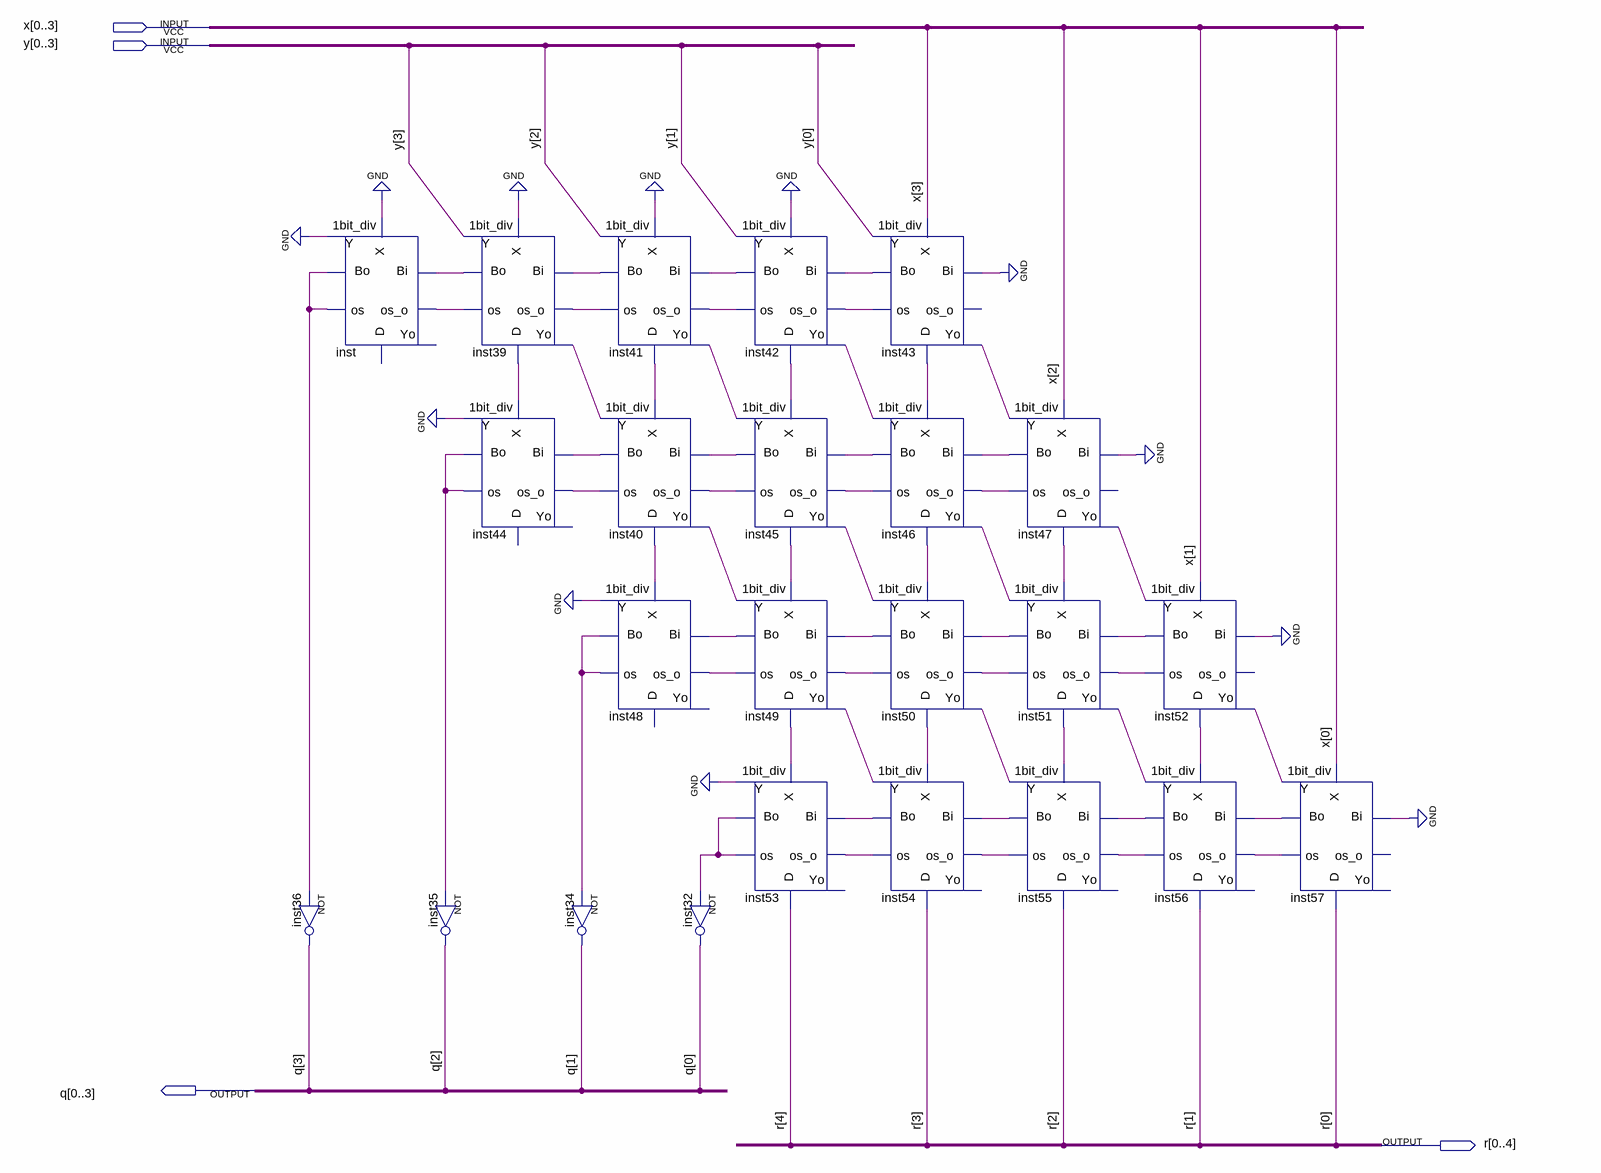
[diagram p0: schematic sheet]
// Quartus schematic 4bit_div.bdf as structural Verilog: 24 symbols, 4 pins
module \4bit_div  (
  input  [0:3] x,
  input  [0:3] y,
  output [0:3] q,
  output [0:4] r
);

  wire inst39_bo, inst39_d, inst39_os_o, inst39_yo, inst40_bo, inst40_d, inst40_os_o, inst40_yo, inst41_bo,
       inst41_d, inst41_os_o, inst41_yo, inst42_bo, inst42_d, inst42_os_o, inst42_yo, inst43_bo, inst43_d,
       inst43_yo, inst44_bo, inst44_os_o, inst45_bo, inst45_d, inst45_os_o, inst45_yo, inst46_bo, inst46_d,
       inst46_os_o, inst46_yo, inst47_bo, inst47_d, inst47_yo, inst48_bo, inst48_os_o, inst49_bo, inst49_d,
       inst49_os_o, inst49_yo, inst50_bo, inst50_d, inst50_os_o, inst50_yo, inst51_bo, inst51_d, inst51_os_o,
       inst51_yo, inst52_bo, inst52_d, inst52_yo, inst53_bo, inst53_os_o, inst54_bo, inst54_os_o, inst55_bo,
       inst55_os_o, inst56_bo, inst56_os_o, inst57_bo, inst_bo, inst_os_o;

  \1bit_div  inst (.Y(1'b0), .X(1'b0), .Bi(inst39_bo), .os(inst_bo), .Bo(inst_bo), .os_o(inst_os_o));  // open: Yo, D
  not inst36 (q[3], inst_bo);
  \1bit_div  inst39 (
    .Y(y[3]), .X(1'b0), .Bi(inst41_bo), .os(inst_os_o), .Yo(inst39_yo), .Bo(inst39_bo), .os_o(inst39_os_o),
    .D(inst39_d));
  \1bit_div  inst44 (
    .Y(1'b0), .X(inst39_d), .Bi(inst40_bo), .os(inst44_bo), .Bo(inst44_bo), .os_o(inst44_os_o));  // open: Yo, D
  not inst35 (q[2], inst44_bo);
  \1bit_div  inst41 (
    .Y(y[2]), .X(1'b0), .Bi(inst42_bo), .os(inst39_os_o), .Yo(inst41_yo), .Bo(inst41_bo), .os_o(inst41_os_o),
    .D(inst41_d));
  \1bit_div  inst40 (
    .Y(inst39_yo), .X(inst41_d), .Bi(inst45_bo), .os(inst44_os_o), .Yo(inst40_yo), .Bo(inst40_bo),
    .os_o(inst40_os_o), .D(inst40_d));
  \1bit_div  inst48 (
    .Y(1'b0), .X(inst40_d), .Bi(inst49_bo), .os(inst48_bo), .Bo(inst48_bo), .os_o(inst48_os_o));  // open: Yo, D
  not inst34 (q[1], inst48_bo);
  not inst32 (q[0], inst53_bo);
  \1bit_div  inst42 (
    .Y(y[1]), .X(1'b0), .Bi(inst43_bo), .os(inst41_os_o), .Yo(inst42_yo), .Bo(inst42_bo), .os_o(inst42_os_o),
    .D(inst42_d));
  \1bit_div  inst45 (
    .Y(inst41_yo), .X(inst42_d), .Bi(inst46_bo), .os(inst40_os_o), .Yo(inst45_yo), .Bo(inst45_bo),
    .os_o(inst45_os_o), .D(inst45_d));
  \1bit_div  inst49 (
    .Y(inst40_yo), .X(inst45_d), .Bi(inst50_bo), .os(inst48_os_o), .Yo(inst49_yo), .Bo(inst49_bo),
    .os_o(inst49_os_o), .D(inst49_d));
  \1bit_div  inst53 (
    .Y(1'b0), .X(inst49_d), .Bi(inst54_bo), .os(inst53_bo), .Bo(inst53_bo), .os_o(inst53_os_o), .D(r[4]));  // open: Yo
  \1bit_div  inst43 (
    .Y(y[0]), .X(x[3]), .Bi(1'b0), .os(inst42_os_o), .Yo(inst43_yo), .Bo(inst43_bo), .D(inst43_d));  // open: os_o
  \1bit_div  inst46 (
    .Y(inst42_yo), .X(inst43_d), .Bi(inst47_bo), .os(inst45_os_o), .Yo(inst46_yo), .Bo(inst46_bo),
    .os_o(inst46_os_o), .D(inst46_d));
  \1bit_div  inst50 (
    .Y(inst45_yo), .X(inst46_d), .Bi(inst51_bo), .os(inst49_os_o), .Yo(inst50_yo), .Bo(inst50_bo),
    .os_o(inst50_os_o), .D(inst50_d));
  \1bit_div  inst54 (
    .Y(inst49_yo), .X(inst50_d), .Bi(inst55_bo), .os(inst53_os_o), .Bo(inst54_bo), .os_o(inst54_os_o),
    .D(r[3]));  // open: Yo
  \1bit_div  inst47 (
    .Y(inst43_yo), .X(x[2]), .Bi(1'b0), .os(inst46_os_o), .Yo(inst47_yo), .Bo(inst47_bo), .D(inst47_d));  // open: os_o
  \1bit_div  inst51 (
    .Y(inst46_yo), .X(inst47_d), .Bi(inst52_bo), .os(inst50_os_o), .Yo(inst51_yo), .Bo(inst51_bo),
    .os_o(inst51_os_o), .D(inst51_d));
  \1bit_div  inst55 (
    .Y(inst50_yo), .X(inst51_d), .Bi(inst56_bo), .os(inst54_os_o), .Bo(inst55_bo), .os_o(inst55_os_o),
    .D(r[2]));  // open: Yo
  \1bit_div  inst52 (
    .Y(inst47_yo), .X(x[1]), .Bi(1'b0), .os(inst51_os_o), .Yo(inst52_yo), .Bo(inst52_bo), .D(inst52_d));  // open: os_o
  \1bit_div  inst56 (
    .Y(inst51_yo), .X(inst52_d), .Bi(inst57_bo), .os(inst55_os_o), .Bo(inst56_bo), .os_o(inst56_os_o),
    .D(r[1]));  // open: Yo
  \1bit_div  inst57 (.Y(inst52_yo), .X(x[0]), .Bi(1'b0), .os(inst56_os_o), .Bo(inst57_bo), .D(r[0]));  // open: Yo, os_o
endmodule
